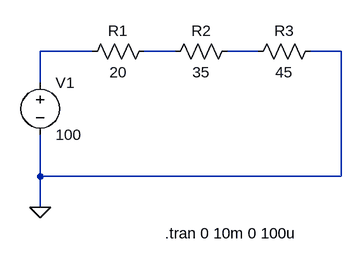
[diagram p0: schematic Ckt_Diag_1.asc]
Ckt_Diag_1.asc, the LTspice schematic file:
Version 4
SHEET 1 880 680
WIRE 112 -48 32 -48
WIRE 240 -48 192 -48
WIRE 368 -48 320 -48
WIRE 496 -48 448 -48
WIRE 32 0 32 -48
WIRE 32 144 32 80
WIRE 496 144 496 -48
WIRE 496 144 32 144
WIRE 32 192 32 144
FLAG 32 192 0
SYMBOL res 96 -32 R270
WINDOW 0 32 56 VTop 2
WINDOW 3 0 56 VBottom 2
SYMATTR InstName R1
SYMATTR Value 20
SYMBOL res 336 -64 R90
WINDOW 0 0 56 VBottom 2
WINDOW 3 32 56 VTop 2
SYMATTR InstName R2
SYMATTR Value 35
SYMBOL res 464 -64 R90
WINDOW 0 0 56 VBottom 2
WINDOW 3 32 56 VTop 2
SYMATTR InstName R3
SYMATTR Value 45
SYMBOL voltage 32 -16 R0
WINDOW 123 0 0 Left 0
WINDOW 39 0 0 Left 0
SYMATTR InstName V1
SYMATTR Value 100
TEXT 224 232 Left 2 !.tran 0 10m 0 100u

The netlist it stands for:
* Ckt_Diag_1.asc
R1 N001 N002 20
R2 N003 N002 35
R3 0 N003 45
V1 N001 0 100
.tran 0 10m 0 100u
.backanno
.end